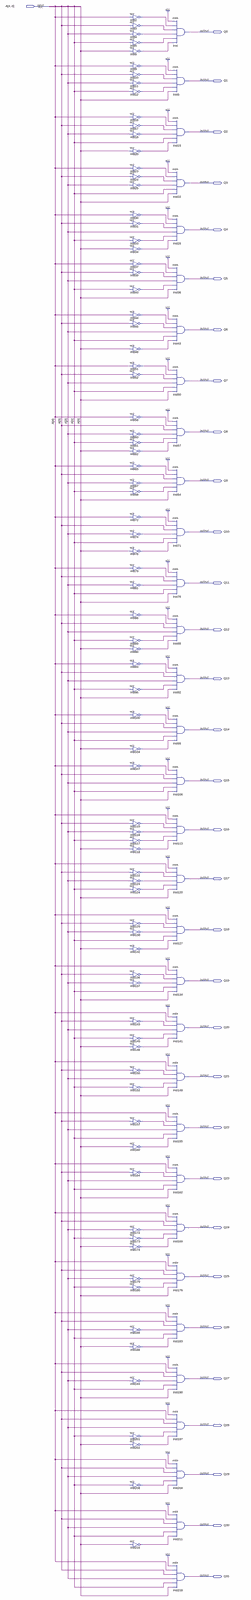
[diagram p0: schematic sheet, whole]
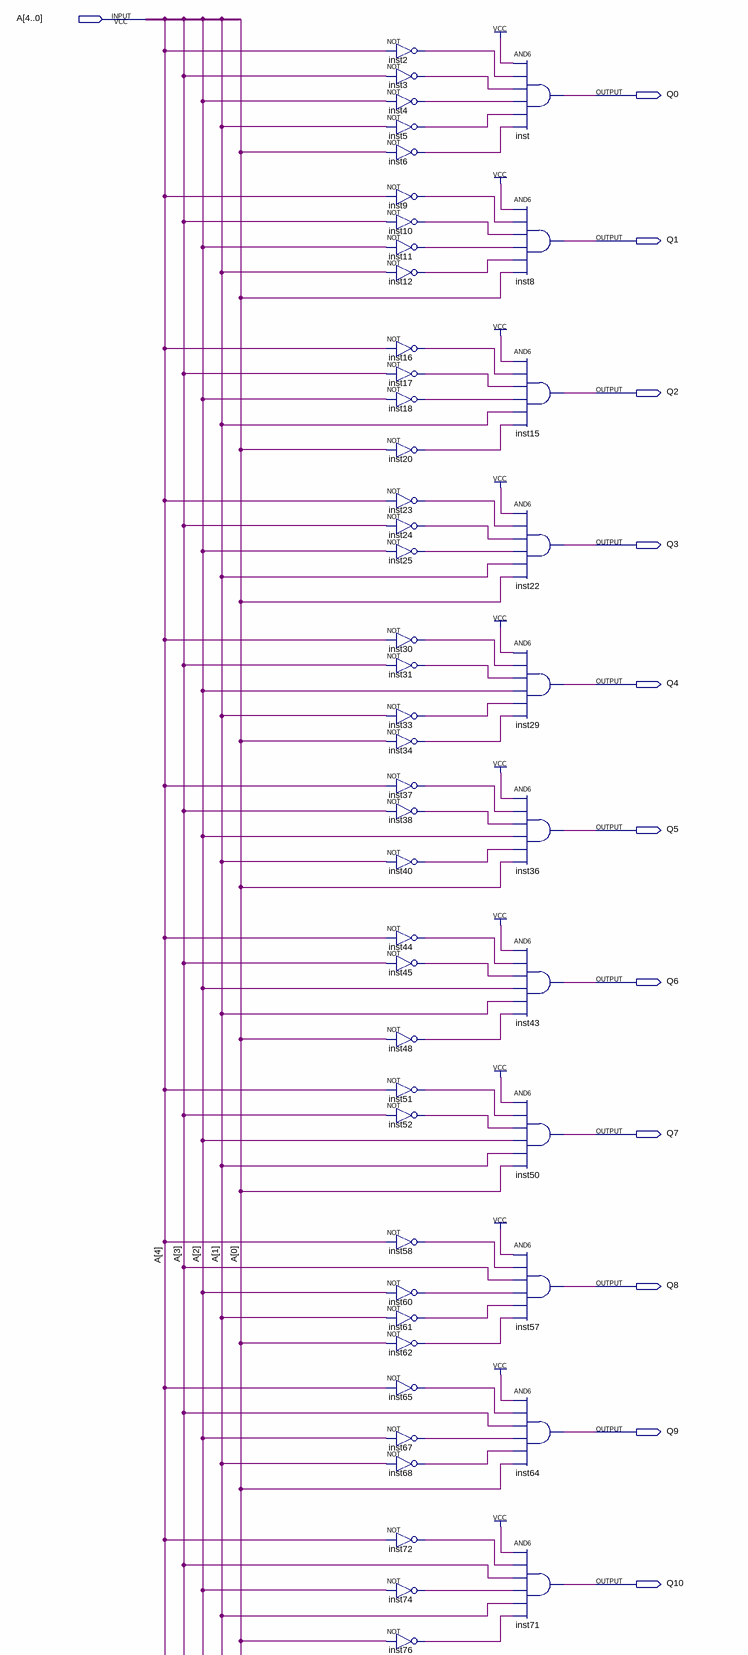
[diagram p1: schematic sheet, upper part]
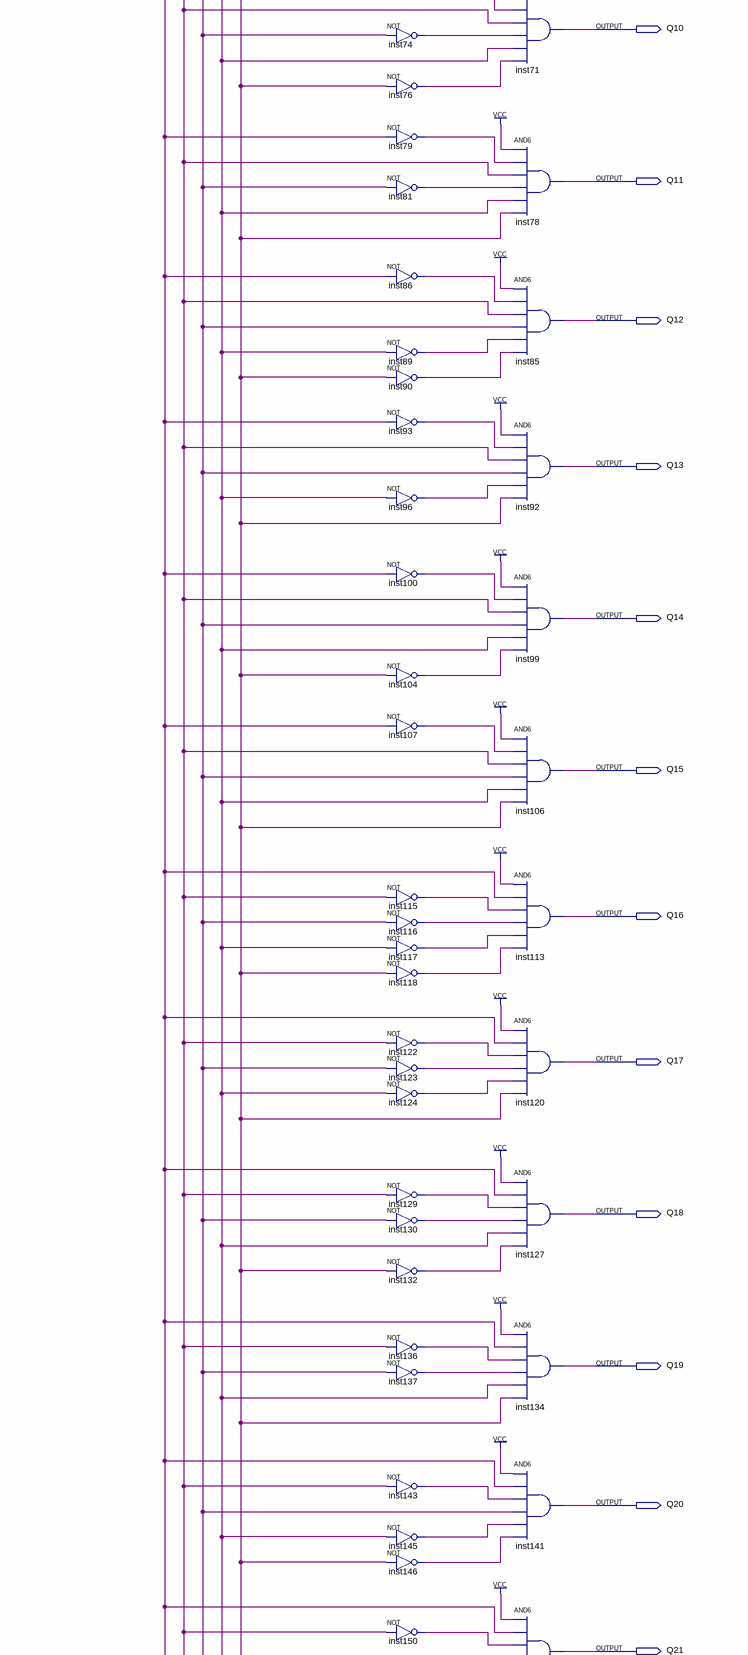
[diagram p2: schematic sheet, middle part]
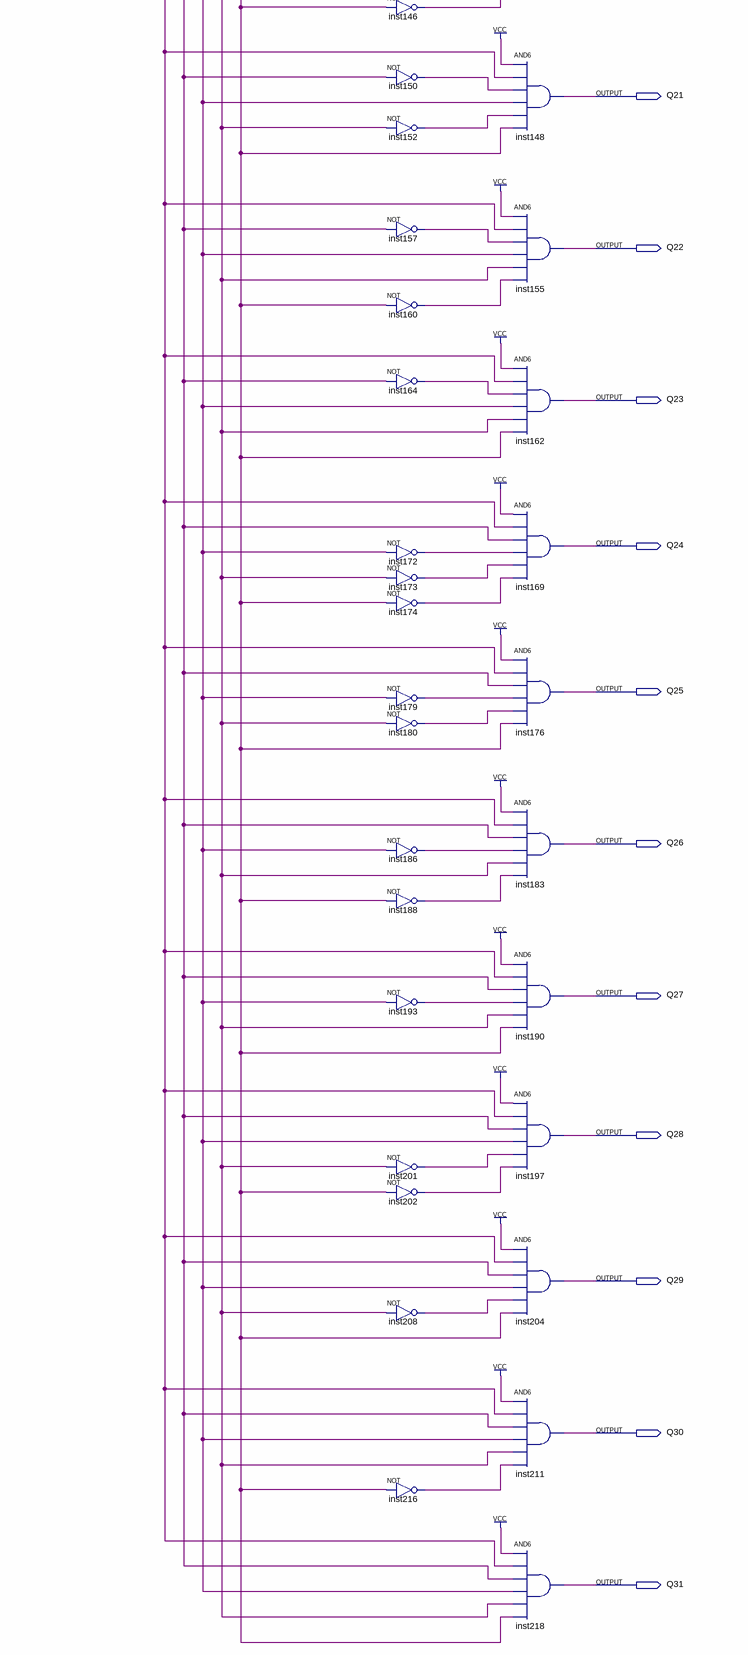
[diagram p3: schematic sheet, lower part]
// Quartus schematic Decoder_32.bdf as structural Verilog: 112 symbols, 33 pins
module Decoder_32 (
  input  [4:0] A,
  output Q0,
  output Q1,
  output Q2,
  output Q3,
  output Q4,
  output Q5,
  output Q6,
  output Q7,
  output Q8,
  output Q9,
  output Q10,
  output Q11,
  output Q12,
  output Q13,
  output Q14,
  output Q15,
  output Q16,
  output Q17,
  output Q18,
  output Q19,
  output Q20,
  output Q21,
  output Q22,
  output Q23,
  output Q24,
  output Q25,
  output Q26,
  output Q27,
  output Q28,
  output Q29,
  output Q30,
  output Q31
);

  wire inst2_out, inst3_out, inst4_out, inst5_out, inst6_out, inst9_out, inst10_out, inst11_out, inst12_out,
       inst16_out, inst17_out, inst18_out, inst20_out, inst23_out, inst24_out, inst25_out, inst30_out,
       inst31_out, inst33_out, inst34_out, inst37_out, inst38_out, inst40_out, inst44_out, inst45_out,
       inst48_out, inst51_out, inst52_out, inst58_out, inst60_out, inst61_out, inst62_out, inst65_out,
       inst67_out, inst68_out, inst72_out, inst74_out, inst76_out, inst79_out, inst81_out, inst86_out,
       inst89_out, inst90_out, inst93_out, inst96_out, inst100_out, inst104_out, inst107_out, inst115_out,
       inst116_out, inst117_out, inst118_out, inst122_out, inst123_out, inst124_out, inst129_out,
       inst130_out, inst132_out, inst136_out, inst137_out, inst143_out, inst145_out, inst146_out,
       inst150_out, inst152_out, inst157_out, inst160_out, inst164_out, inst172_out, inst173_out,
       inst174_out, inst179_out, inst180_out, inst186_out, inst188_out, inst193_out, inst201_out,
       inst202_out, inst208_out, inst216_out;

  not inst2 (inst2_out, A[4]);
  not inst3 (inst3_out, A[3]);
  not inst4 (inst4_out, A[2]);
  not inst5 (inst5_out, A[1]);
  not inst6 (inst6_out, A[0]);
  not inst9 (inst9_out, A[4]);
  not inst10 (inst10_out, A[3]);
  not inst11 (inst11_out, A[2]);
  not inst12 (inst12_out, A[1]);
  not inst16 (inst16_out, A[4]);
  not inst17 (inst17_out, A[3]);
  not inst18 (inst18_out, A[2]);
  not inst20 (inst20_out, A[0]);
  not inst23 (inst23_out, A[4]);
  not inst24 (inst24_out, A[3]);
  not inst25 (inst25_out, A[2]);
  not inst30 (inst30_out, A[4]);
  not inst31 (inst31_out, A[3]);
  not inst33 (inst33_out, A[1]);
  not inst34 (inst34_out, A[0]);
  not inst37 (inst37_out, A[4]);
  not inst38 (inst38_out, A[3]);
  not inst40 (inst40_out, A[1]);
  not inst44 (inst44_out, A[4]);
  not inst45 (inst45_out, A[3]);
  not inst48 (inst48_out, A[0]);
  not inst51 (inst51_out, A[4]);
  not inst52 (inst52_out, A[3]);
  not inst58 (inst58_out, A[4]);
  not inst60 (inst60_out, A[2]);
  not inst61 (inst61_out, A[1]);
  not inst62 (inst62_out, A[0]);
  not inst65 (inst65_out, A[4]);
  not inst67 (inst67_out, A[2]);
  not inst68 (inst68_out, A[1]);
  not inst72 (inst72_out, A[4]);
  not inst74 (inst74_out, A[2]);
  not inst76 (inst76_out, A[0]);
  not inst79 (inst79_out, A[4]);
  not inst81 (inst81_out, A[2]);
  not inst86 (inst86_out, A[4]);
  not inst89 (inst89_out, A[1]);
  not inst90 (inst90_out, A[0]);
  not inst93 (inst93_out, A[4]);
  not inst96 (inst96_out, A[1]);
  not inst100 (inst100_out, A[4]);
  not inst104 (inst104_out, A[0]);
  not inst107 (inst107_out, A[4]);
  not inst115 (inst115_out, A[3]);
  not inst116 (inst116_out, A[2]);
  not inst117 (inst117_out, A[1]);
  not inst118 (inst118_out, A[0]);
  not inst122 (inst122_out, A[3]);
  not inst123 (inst123_out, A[2]);
  not inst124 (inst124_out, A[1]);
  not inst129 (inst129_out, A[3]);
  not inst130 (inst130_out, A[2]);
  not inst132 (inst132_out, A[0]);
  not inst136 (inst136_out, A[3]);
  not inst137 (inst137_out, A[2]);
  not inst143 (inst143_out, A[3]);
  not inst145 (inst145_out, A[1]);
  not inst146 (inst146_out, A[0]);
  not inst150 (inst150_out, A[3]);
  not inst152 (inst152_out, A[1]);
  not inst157 (inst157_out, A[3]);
  not inst160 (inst160_out, A[0]);
  not inst164 (inst164_out, A[3]);
  not inst172 (inst172_out, A[2]);
  not inst173 (inst173_out, A[1]);
  not inst174 (inst174_out, A[0]);
  not inst179 (inst179_out, A[2]);
  not inst180 (inst180_out, A[1]);
  not inst186 (inst186_out, A[2]);
  not inst188 (inst188_out, A[0]);
  not inst193 (inst193_out, A[2]);
  not inst201 (inst201_out, A[1]);
  not inst202 (inst202_out, A[0]);
  not inst208 (inst208_out, A[1]);
  not inst216 (inst216_out, A[0]);
  and inst (Q0, 1'b1, inst2_out, inst3_out, inst4_out, inst5_out, inst6_out);
  and inst8 (Q1, 1'b1, inst9_out, inst10_out, inst11_out, inst12_out, A[0]);
  and inst15 (Q2, 1'b1, inst16_out, inst17_out, inst18_out, A[1], inst20_out);
  and inst22 (Q3, 1'b1, inst23_out, inst24_out, inst25_out, A[1], A[0]);
  and inst29 (Q4, 1'b1, inst30_out, inst31_out, A[2], inst33_out, inst34_out);
  and inst36 (Q5, 1'b1, inst37_out, inst38_out, A[2], inst40_out, A[0]);
  and inst43 (Q6, 1'b1, inst44_out, inst45_out, A[2], A[1], inst48_out);
  and inst50 (Q7, 1'b1, inst51_out, inst52_out, A[2], A[1], A[0]);
  and inst57 (Q8, 1'b1, inst58_out, A[3], inst60_out, inst61_out, inst62_out);
  and inst64 (Q9, 1'b1, inst65_out, A[3], inst67_out, inst68_out, A[0]);
  and inst71 (Q10, 1'b1, inst72_out, A[3], inst74_out, A[1], inst76_out);
  and inst78 (Q11, 1'b1, inst79_out, A[3], inst81_out, A[1], A[0]);
  and inst85 (Q12, 1'b1, inst86_out, A[3], A[2], inst89_out, inst90_out);
  and inst92 (Q13, 1'b1, inst93_out, A[3], A[2], inst96_out, A[0]);
  and inst99 (Q14, 1'b1, inst100_out, A[3], A[2], A[1], inst104_out);
  and inst106 (Q15, 1'b1, inst107_out, A[3], A[2], A[1], A[0]);
  and inst113 (Q16, 1'b1, A[4], inst115_out, inst116_out, inst117_out, inst118_out);
  and inst120 (Q17, 1'b1, A[4], inst122_out, inst123_out, inst124_out, A[0]);
  and inst127 (Q18, 1'b1, A[4], inst129_out, inst130_out, A[1], inst132_out);
  and inst134 (Q19, 1'b1, A[4], inst136_out, inst137_out, A[1], A[0]);
  and inst141 (Q20, 1'b1, A[4], inst143_out, A[2], inst145_out, inst146_out);
  and inst148 (Q21, 1'b1, A[4], inst150_out, A[2], inst152_out, A[0]);
  and inst155 (Q22, 1'b1, A[4], inst157_out, A[2], A[1], inst160_out);
  and inst162 (Q23, 1'b1, A[4], inst164_out, A[2], A[1], A[0]);
  and inst169 (Q24, 1'b1, A[4], A[3], inst172_out, inst173_out, inst174_out);
  and inst176 (Q25, 1'b1, A[4], A[3], inst179_out, inst180_out, A[0]);
  and inst183 (Q26, 1'b1, A[4], A[3], inst186_out, A[1], inst188_out);
  and inst190 (Q27, 1'b1, A[4], A[3], inst193_out, A[1], A[0]);
  and inst197 (Q28, 1'b1, A[4], A[3], A[2], inst201_out, inst202_out);
  and inst204 (Q29, 1'b1, A[4], A[3], A[2], inst208_out, A[0]);
  and inst211 (Q30, 1'b1, A[4], A[3], A[2], A[1], inst216_out);
  and inst218 (Q31, 1'b1, A[4], A[3], A[2], A[1], A[0]);
endmodule
